# EAGLE design stx_ra02 (EAGLE 7.7.0)
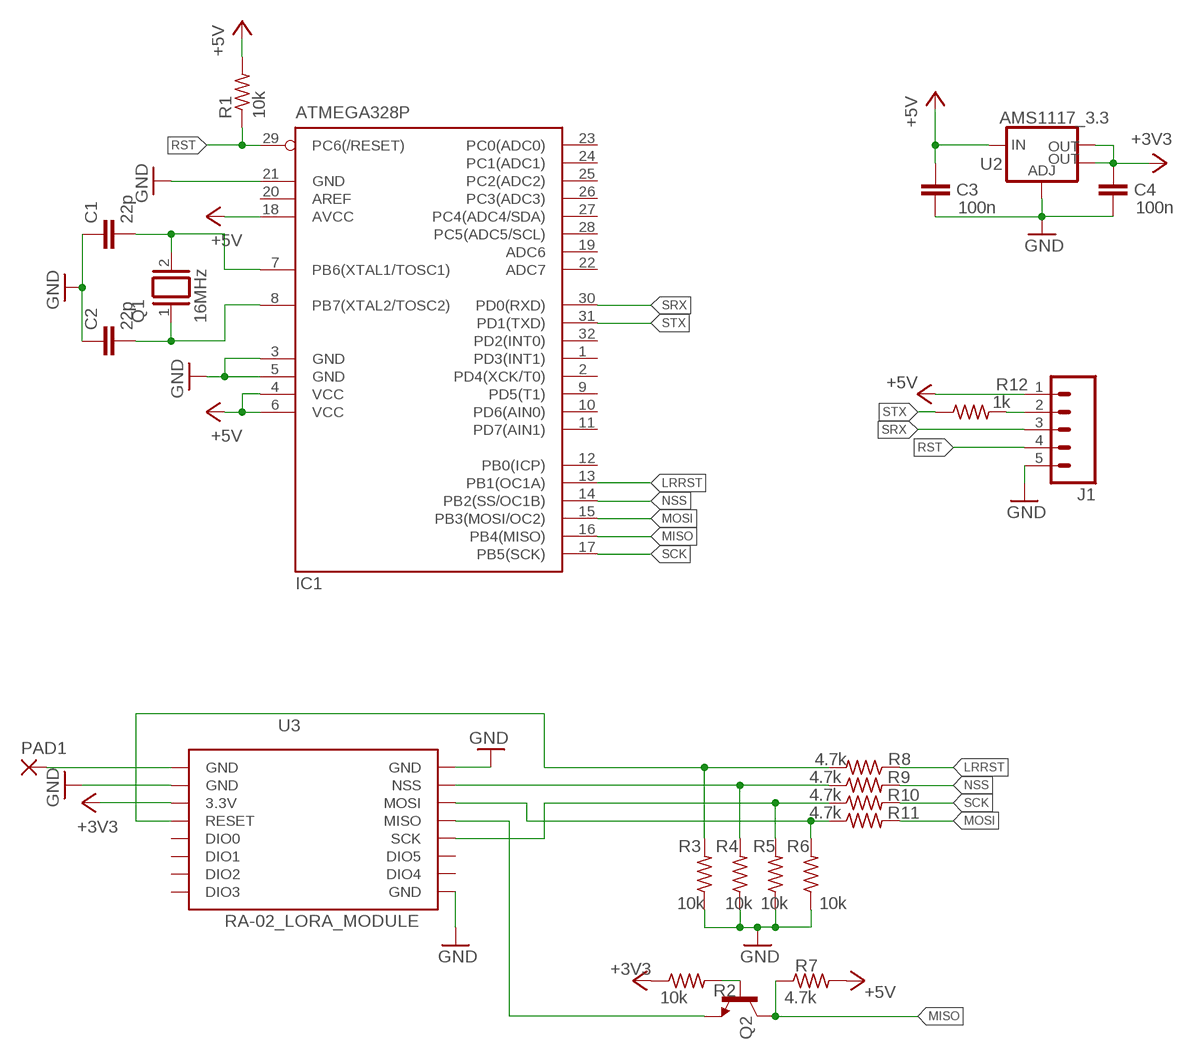
[diagram p0: schematic, sheet 1]

## Parts
C1  22p  C-EUC0805K  [C0805K]
C2  22p  C-EUC0805K  [C0805K]
C3  100n  C-EUC0805K  [C0805K]
C4  100n  C-EUC0805K  [C0805K]
IC1  ATMEGA328P  MEGA8-AI  [TQFP32-08]
J1  M05PTH  [1X05]
PAD1  2,15/1,0  [2,15/1,0]
Q1  16MHz  XTAL/S  [QS]
Q2  BC817-16SMD  [SOT23-BEC]
R1  10k  R-US_R0805  [R0805]
R2  10k  R-US_R0805  [R0805]
R3  10k  R-US_R0805  [R0805]
R4  10k  R-US_R0805  [R0805]
R5  10k  R-US_R0805  [R0805]
R6  10k  R-US_R0805  [R0805]
R7  4.7k  R-US_R0805  [R0805]
R8  4.7k  R-US_R0805  [R0805]
R9  4.7k  R-US_R0805  [R0805]
R10  4.7k  R-US_R0805  [R0805]
R11  4.7k  R-US_R0805  [R0805]
R12  1k  R-US_R0805  [R0805]
U2  AMS1117_3.3  V_REG_LM1117SOT223  [SOT223]
U3  RA-02_LORA_MODULE  [RA-02]

## Nets
+3V3: C4.2 R2.1 U2.2(OUT) U2.4(OUT) U3.3.3V
+5V: C3.2 IC1.4(VCC) IC1.6(VCC) IC1.18(AVCC) J1.1 R1.2 R7.2 U2.3(IN)
GND: C1.1 C2.1 C3.1 C4.1 IC1.3(GND) IC1.5(GND) IC1.21(GND) J1.5 R3.1 R4.1 R5.1 R6.1 U2.1(ADJ) U3.GND@2(GND) U3.GND@3(GND) U3.GND@4(GND)
LRRST: IC1.13(PB1(OC1A)) R8.1
MISO: IC1.16(PB4(MISO)) Q2.C R7.1
MOSI: IC1.15(PB3(MOSI/OC2)) R11.2
N$1: C1.2 IC1.7(PB6(XTAL1/TOSC1)) Q1.2
N$2: J1.2 R12.2
N$3: C2.2 IC1.8(PB7(XTAL2/TOSC2)) Q1.1
N$4: R3.2 R8.2 U3.RESET
N$5: PAD1.1(P) U3.GND
N$6: Q2.E U3.MISO
N$7: R4.2 R9.1 U3.NSS
N$8: R5.2 R10.1 U3.SCK
N$9: R6.2 R11.1 U3.MOSI
N$33: Q2.B R2.2
NSS: IC1.14(PB2(SS/OC1B)) R9.2
RST: IC1.29(PC6(/RESET)) J1.4 R1.1
SCK: IC1.17(PB5(SCK)) R10.2
SRX: IC1.30(PD0(RXD)) J1.3
STX: IC1.31(PD1(TXD)) R12.1
Unconnected: IC1.1(PD3(INT1)) IC1.2(PD4(XCK/T0)) IC1.9(PD5(T1)) IC1.10(PD6(AIN0)) IC1.11(PD7(AIN1)) IC1.12(PB0(ICP)) IC1.19(ADC6) IC1.20(AREF) IC1.22(ADC7) IC1.23(PC0(ADC0)) IC1.24(PC1(ADC1)) IC1.25(PC2(ADC2)) IC1.26(PC3(ADC3)) IC1.27(PC4(ADC4/SDA)) IC1.28(PC5(ADC5/SCL)) IC1.32(PD2(INT0)) U3.DIO0 U3.DIO1 U3.DIO2 U3.DIO3 U3.DIO4 U3.DIO5

## Library data of the parts
C1-C4 = rcl:C-EU: CAPACITOR, European symbol
IC1 = atmel:MEGA8: MICROCONTROLLER 8 Kbytes FLASH, 1 kbytes SRAM, 512 bytes EEPROM, USART, 6-channel 10 bit ADC, 2-channel 8 bit ADC Pin compatible with Atmega48, ATMega88, ATMega168 Source: avr.lbr; MPN: ATMEGA8-16AU; OC_FARNELL: 9171371; OC_NEWARK: 73M8863
J1 = SparkFun-Connectors:M05: Header 5 Standard 5-pin 0.1" header. Use with straight break away headers (SKU : PRT-00116), right angle break away headers (PRT-00553), swiss pins (PRT-00743), machine pins (PRT-00117), and female headers (PRT-00115). Molex polarized connector foot print use with SKU : PRT-08230 with associated crimp pins and housings.
PAD1 = wirepad:2,15/1,0: THROUGH-HOLE PAD
Q1 = special:XTAL/S: CRYSTAL
Q2 = transistor-npn:BC817*: NPN Transistor
R1-R12 = rcl:R-US_: RESISTOR, American symbol
U2 = SparkFun-PowerIC:V_REG_LM1117: Voltage Regulator LM1117 Standard adjustable voltage regulator but in SMD form. Spark Fun Electronics SKU : COM-00595; PROD_ID: VREG-08170
U3 = RA-02_Lora_module:RA-02_LORA_MODULE

## Net classes
1 rf: clearance 0.5 mm

## Board
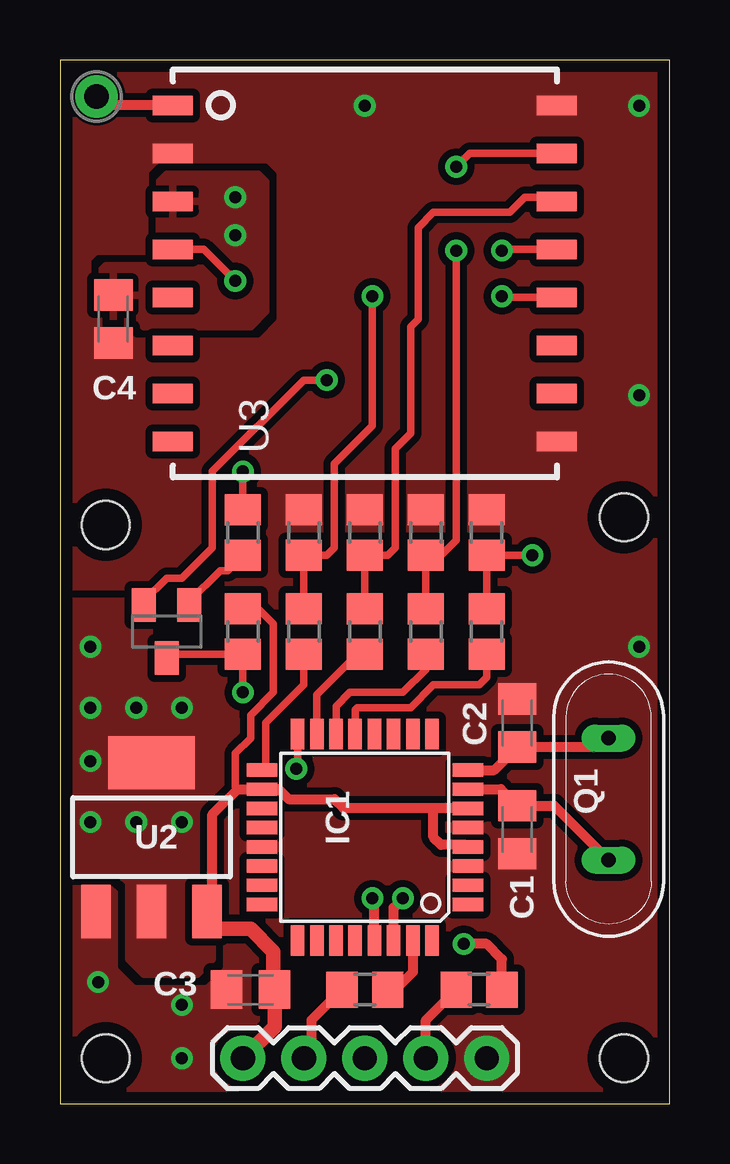
[diagram p1: board, top side]
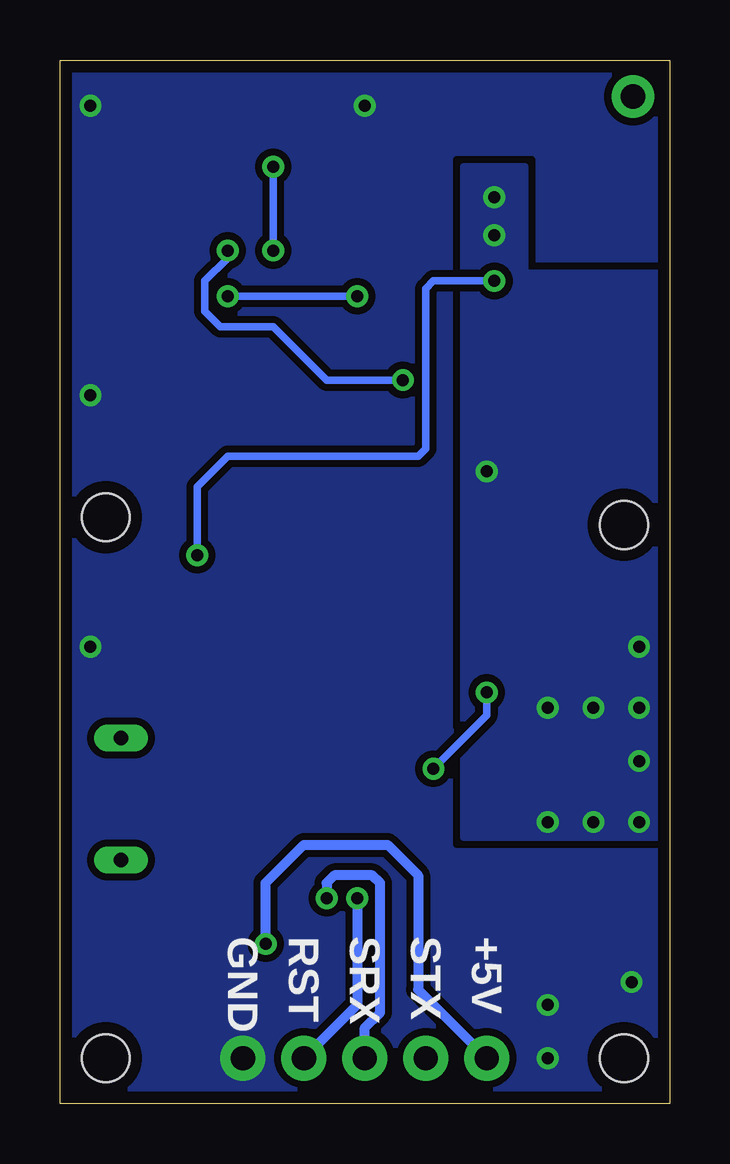
[diagram p2: board, bottom side, seen from below]

Size 25.4 x 43.5 mm. Coordinates in mm from the lower left corner, seen from the top.
Outline: 0,0 25.4,0 25.4,43.5 0,43.5 0,0
Copper layers (1*16): Top 0.035mm / dielectric 1.5mm / Bottom 0.035mm
Design rules "default *": minimum track width 10mil, minimum drill 0.5mm, track to track 0.3mm, track to pad 0.3mm, pad to pad 0.3mm, via to via 0.3mm, smd to smd 8mil, copper to edge 0.5mm, drill to drill 8mil, minimum pad ring 10mil, minimum via ring 8mil, stop-mask expansion 4mil, vias tented up to drill 0.8mm, thermal gap 10mil
Holes 2 mm at 1.91,1.91 23.5,1.91 23.5,24.45 1.91,24.13

### Footprints (pad centres in the part's own frame; a part is rotated, then mirrored left to right if it is on the bottom)
C0805K = smd 1.3 x 1.6: 1 -1,0; 2 1,0
TQFP32-08 = smd 1.27 x 0.559: 1 -4.293,2.8; 2 -4.293,2; 3 -4.293,1.2; 4 -4.293,0.4; 5 -4.293,-0.4; 6 -4.293,-1.2; 7 -4.293,-2; 8 -4.293,-2.8; 17 4.293,-2.8; 18 4.293,-2; 19 4.293,-1.2; 20 4.293,-0.4; 21 4.293,0.4; 22 4.293,1.2; 23 4.293,2; 24 4.293,2.8 | smd 0.559 x 1.27: 9 -2.8,-4.293; 10 -2,-4.293; 11 -1.2,-4.293; 12 -0.4,-4.293; 13 0.4,-4.293; 14 1.2,-4.293; 15 2,-4.293; 16 2.8,-4.293; 25 2.8,4.293; 26 2,4.293; 27 1.2,4.293; 28 0.4,4.293; 29 -0.4,4.293; 30 -1.2,4.293; 31 -2,4.293; 32 -2.8,4.293
1X05 = drill 1.016 pad 1.88: 1 0,0; 2 2.54,0; 3 5.08,0; 4 7.62,0; 5 10.16,0
2,15/1,0 = drill 1.016 pad 1.778: 1 0,0
QS = drill 0.61 long: 1 -2.54,0; 2 2.54,0
SOT23-BEC = smd 1 x 1.4: B -0.95,-1.1; C 0,1.1; E 0.95,-1.1
R0805 = smd 1.3 x 1.5: 1 -0.95,0; 2 0.95,0
SOT223 = smd 1.219 x 2.235: 1 -2.311,-3.099; 2 0,-3.099; 3 2.311,-3.099 | smd 3.6 x 2.2: 4 0,3.099
RA-02 = smd 1.676 x 0.813: 3.3V -8,3; DIO0 -8,-1; DIO1 -8,-3; DIO2 -8,-5; DIO3 -8,-7; DIO4 8,-5; DIO5 8,-3; GND -8,7; GND@2 -8,5; GND@3 8,-7; GND@4 8,7; MISO 8,1; MOSI 8,3; NSS 8,5; RESET -8,1; SCK 8,-1

### Placement (x,y rotation side)
C1  19.05,11.43 90 top
C2  19.05,15.88 270 top
C3  7.94,4.76 0 top
C4  2.22,32.7 90 top
IC1  12.7,11.11 180 top
J1  7.62,1.91 0 top
PAD1  1.52,41.98 0 top
Q1  22.86,12.7 270 top
Q2  4.45,19.68 180 top
R1  17.46,4.76 0 top
R2  7.62,23.81 270 top
R3  17.78,23.81 270 top
R4  15.24,23.81 270 top
R5  10.16,23.81 270 top
R6  12.7,23.81 270 top
R7  7.62,19.68 90 top
R8  17.78,19.68 90 top
R9  15.24,19.68 270 top
R10  10.16,19.68 270 top
R11  12.7,19.68 270 top
R12  12.7,4.76 180 top
U2  3.81,11.11 0 top
U3  12.7,34.61 0 top

### Tracks (layer width: path | path; a pad name or v marks a point on that pad's centre or on a via)
+3V3  (via drill 0.5)
  Top 0.305: 2,33.61 C4.2 | R2.1 v7.62,26.35
  other vias: 5.08,11.75 3.17,11.75 1.27,11.75 1.27,16.51 3.17,16.51 5.08,16.51 1.27,19.05 1.27,14.29 7.3,37.78 7.3,36.2
  pour Top (isolate 0.305, no thermals): 0,20.95 6.67,20.95 7.62,20 7.62,13.34 6.35,12.06 6.35,6.03 5.71,5.4 3.49,5.4 2.86,6.03 2.86,9.21 2.54,9.53 0.64,9.53 0.32,9.84 0.32,18.73 0,19.05
  pour Bottom (isolate 0.305, no thermals): 0,11.11 8.57,11.11 8.57,39.05 6.03,39.05 6.03,34.61 0,34.61
  pour Top (isolate 0.305): 4.45,38.73 8.26,38.73 8.57,38.42 8.57,33.02 7.94,32.38 3.49,32.38 3.17,32.7 1.59,32.7 1.59,34.61 1.91,34.92 3.49,34.92 4.13,35.56 4.13,38.42
+5V  (via drill 0.5)
  Top 0.305: R7.2 8.26,20.64 8.89,20 8.89,17.14 7.94,16.19 7.94,15.24 7.3,14.61 7.3,13.21 7.4,13.11
  Top 0.406: IC1.6 15.56,12.31 | 15.56,12.31 11.82,12.31 11.43,12.7 9.53,12.7 9.11,13.11 IC1.18 7.4,13.11 6.35,12.06 6.35,8.24 U2.3 | IC1.4 16.91,10.79 15.88,10.79 15.56,11.11 15.56,12.31 | R1.2 18.41,6.03 17.78,6.67 v16.83,6.67
  Top 0.61: J1.1 8.94,3.22 C3.2 8.89,4.81 8.89,6.35 7.94,7.3 6.35,7.3 6.12,7.53 U2.3
  Bottom 0.406: v16.83,6.67 16.83,9.21 15.24,10.79 11.75,10.79 10.48,9.53 10.48,4.76 J1.1
GND  (via drill 0.5)
  other vias: 1.59,5.08 5.08,1.91 5.08,4.13 24.13,19.05 24.13,29.53 24.13,41.59 12.7,41.59
  pour Top (isolate 0.254, rank 3, no thermals): 0,43.5 25.4,43.5 25.4,0 0,0
  pour Bottom (isolate 0.254, rank 3, no thermals): -0.64,44.77 26.04,44.77 26.04,-1.27 -0.64,-1.27
LRRST
  Top 0.305: IC1.13 12.3,16.43 12.38,16.51 14.61,16.51 15.56,17.46 17.46,17.46 17.78,17.78 R8.1
MISO  (via drill 0.5)
  Top 0.305: IC1.16 9.9,14.03 v9.84,13.97 | v7.62,17.14 R7.1 4.59,18.73 Q2.C
  Bottom 0.305: v7.62,17.14 7.62,16.19 v9.84,13.97
MOSI
  Top 0.305: IC1.15 10.7,17.05 12.06,18.41 12.38,18.41 R11.2
N$1
  Top 0.406: IC1.7 18.37,13.11 C1.2 20.59,12.43 Q1.2
N$2
  Top 0.406: R12.2 10.48,3.49 10.48,2.22 J1.2
N$3
  Top 0.406: IC1.8 18.09,13.91 C2.2 22.5,14.88 Q1.1
N$4  (via drill 0.5)
  Top 0.305: R8.2 R3.2 v19.68,22.86 | U3.RESET 5.99,35.61 v7.3,34.29
  Bottom 0.305: v19.68,22.86 19.68,25.72 18.41,26.99 10.48,26.99 10.16,27.3 10.16,33.97 9.84,34.29 v7.3,34.29
N$5
  Top 0.406: U3.GND 1.9,41.61 PAD1.1
N$6  (via drill 0.5)
  Top 0.305: Q2.E 3.5,20.96 4.45,21.91 5.08,21.91 6.35,23.18 6.35,26.35 10.16,30.16 v11.11,30.16 | U3.MISO 18.46,35.61 v18.41,35.56
  Bottom 0.305: v18.41,35.56 18.41,35.24 19.37,34.29 19.37,33.02 18.73,32.38 16.51,32.38 14.29,30.16 v11.11,30.16
N$7  (via drill 0.5)
  Top 0.305: R9.1 R4.2 15.88,22.86 16.51,23.5 v16.51,35.56 | U3.NSS 17.07,39.61 v16.51,39.05
  Bottom 0.305: v16.51,35.56 v16.51,39.05
N$8  (via drill 0.5)
  Top 0.305: R10.1 R5.2 11.12,22.86 11.43,23.18 11.43,26.67 13.02,28.26 v13.02,33.66 | U3.SCK 18.46,33.61 v18.41,33.66
  Bottom 0.305: v13.02,33.66 v18.41,33.66
N$9
  Top 0.305: R11.1 R6.2 13.65,22.86 13.97,23.18 13.97,27.3 14.61,27.94 14.61,32.38 14.92,32.7 14.92,36.51 15.56,37.15 18.73,37.15 19.37,37.78 20.52,37.78 U3.MOSI
N$33
  Top 0.305: Q2.B 5.39,20.95 6.67,22.23 6.98,22.23 R2.2
NSS
  Top 0.305: IC1.14 11.5,16.58 12.06,17.14 14.29,17.14 15.24,18.1 R9.2
RST  (via drill 0.5)
  Top 0.406: J1.4 15.24,3.49 R1.1 | IC1.29 13.1,8.49 v13.02,8.57
  Bottom 0.406: v13.02,8.57 13.02,4.13 J1.4
SCK
  Top 0.305: R10.2 10.16,17.46 8.57,15.88 8.57,14.08 IC1.17
SRX  (via drill 0.5)
  Top 0.406: IC1.30 13.9,8.19 v14.29,8.57
  Bottom 0.406: J1.3 12.7,3.17 12.06,3.81 12.06,9.21 12.38,9.53 13.97,9.53 14.29,9.21 v14.29,8.57
STX
  Top 0.406: R12.1 13.97,4.76 14.7,5.49 IC1.31

### Text on the board
bNames: +5V / STX / SRX / RST / GND